# Altium schematic sheet Multiplex_Registers.SchDoc
size A; SheetNumber: 2; SheetTotal: 5
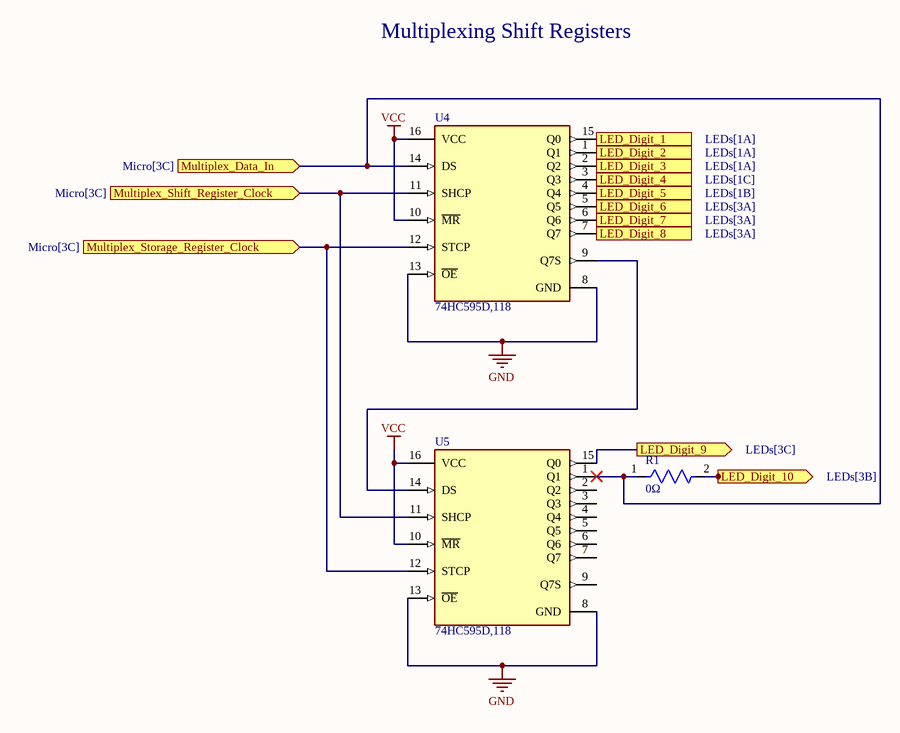
[diagram p0: Multiplex_Registers.SchDoc]

## Parts
R1  CRCW04020000Z0ED  [FP-CRCW0402-e3-IPC_C]  (value not drawn)
U4  74HC595D,118  [FP-SOT109-1-IPC_C]
U5  74HC595D,118  [FP-SOT109-1-IPC_C]

## Ports
LED_Digit_1 (out, see LEDs[1A]), LED_Digit_2 (out, see LEDs[1A]), LED_Digit_3 (out, see LEDs[1A]), LED_Digit_4 (out, see LEDs[1C]), LED_Digit_5 (out, see LEDs[1B]), LED_Digit_6 (out, see LEDs[3A]), LED_Digit_7 (out, see LEDs[3A]), LED_Digit_8 (out, see LEDs[3A]), LED_Digit_9 (out, see LEDs[3C]), LED_Digit_10 (out, see LEDs[3B]), Multiplex_Data_In (in, see Micro[3C]), Multiplex_Shift_Register_Clock (in, see Micro[3C]), Multiplex_Storage_Register_Clock (in, see Micro[3C])

## Nets
GND: U4.8(GND) U4.13(~{OE}) U5.8(GND) U5.13(~{OE})
VCC: U4.10(~{MR}) U4.16(VCC) U5.10(~{MR}) U5.16(VCC)
LED_Digit_1: U4.15(Q0) ; port LED_Digit_1
LED_Digit_2: U4.1(Q1) ; port LED_Digit_2
LED_Digit_3: U4.2(Q2) ; port LED_Digit_3
LED_Digit_4: U4.3(Q3) ; port LED_Digit_4
LED_Digit_5: U4.4(Q4) ; port LED_Digit_5
LED_Digit_6: U4.5(Q5) ; port LED_Digit_6
LED_Digit_7: U4.6(Q6) ; port LED_Digit_7
LED_Digit_8: U4.7(Q7) ; port LED_Digit_8
LED_Digit_9: U5.15(Q0) ; port LED_Digit_9
LED_Digit_10: R1.2 ; port LED_Digit_10
Multiplex_Data_In: R1.1 U4.14(DS) U5.1(Q1) ; port Multiplex_Data_In
Multiplex_Shift_Register_Clock: U4.11(SHCP) U5.11(SHCP) ; port Multiplex_Shift_Register_Clock
Multiplex_Storage_Register_Clock: U4.12(STCP) U5.12(STCP) ; port Multiplex_Storage_Register_Clock
NetU4_9: U4.9(Q7S) U5.14(DS)

Not connected (* = marked no-connect by the designer): U5 2(Q2) 3(Q3) 4(Q4) 5(Q5) 6(Q6) 7(Q7) 9(Q7S)

## Notes on the sheet
- Multiplexing Shift Registers
- (near R1) 0Ω

## Library data of the parts
R1 = CMP-2002-08122-2: RES Thick Film, 0Ω, 0.063W, 0402; Tolerance: 5%; Max Power Dissipation: 63mW; Voltage Rating: 50V; Temperature Coefficient: 100ppm/°C; Resistance: 0mR; Contact Plating: Tin; Height: 0.35mm; Radiation Hardening: No; Features: Automotive AEC-Q200; Composition: Thick Film; Width: 0.5mm; Weight: 2.3E-05oz; Termination: SMD/SMT; Packaging: Tape and Reel; Mount: Surface Mount; Case Code (Metric): 1005; Military Standard: Not; Min Operating Temperature: -55°C; Number of Terminations: 2; Package Quantity: 1; Case Code (Imperial): 0402; Depth: 0.5mm; Max Operating Temperature: 155°C; Case/Package: 0402; Power Rating: 63mW; Lead Free: Lead Free; Voltage Rating (DC): 50V; Length: 1mm
U4 U5 = CMP-14351-000006-1: IC SHIFT REGISTER 8BIT 16SOIC; RoHS Compliant: Yes